# EAGLE design WeldingRectifier (EAGLE 7.4.0)
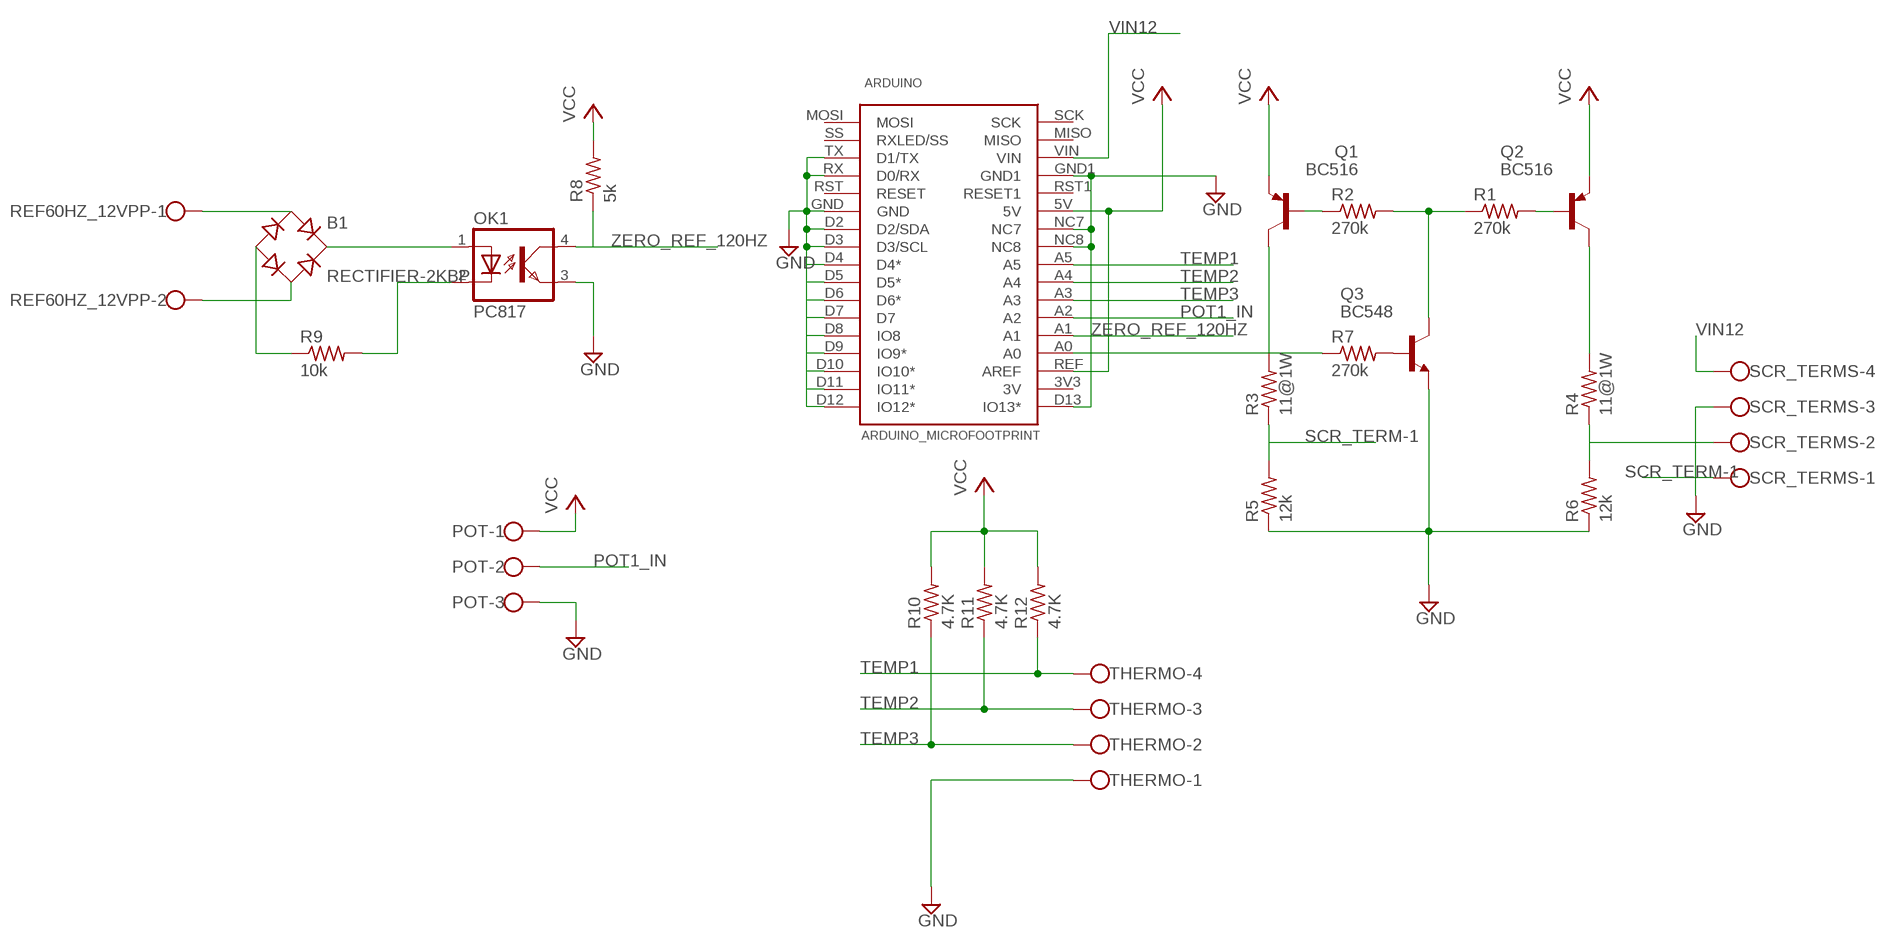
[diagram p0: schematic, sheet 1]

## Parts
ARDUINO  ARDUINO_MICROFOOTPRINT  [ARDUINO-MICRO]
B1  RECTIFIER-2KBP  [2KBP]
OK1  PC817  [DIL04]
POT  W237-103  [W237-103]
Q1  BC516  [TO92-EBC]
Q2  BC516  [TO92-EBC]
Q3  BC548  [TO92-EBC]
R1  270k  R-US_0204/7  [0204/7]
R2  270k  R-US_0204/7  [0204/7]
R3  11@1W  R-US_0204/7  [0204/7]
R4  11@1W  R-US_0204/7  [0204/7]
R5  12k  R-US_0204/7  [0204/7]
R6  12k  R-US_0204/7  [0204/7]
R7  270k  R-US_0204/7  [0204/7]
R8  5k  R-US_0204/7  [0204/7]
R9  10k  R-US_0204/7  [0204/7]
R10  4.7K  R-US_0204/7  [0204/7]
R11  4.7K  R-US_0204/7  [0204/7]
R12  4.7K  R-US_0204/7  [0204/7]
REF60HZ_12VPP  W237-102  [W237-102]
SCR_TERMS  W237-4  [W237-4]
THERMO  W237-4  [W237-4]

## Nets
GND: ARDUINO.D2(D2/SDA) ARDUINO.D3(D3/SCL) ARDUINO.D4(D4*) ARDUINO.D5(D5*) ARDUINO.D6(D6*) ARDUINO.D7 ARDUINO.D8(IO8) ARDUINO.D9(IO9*) ARDUINO.D10(IO10*) ARDUINO.D11(IO11*) ARDUINO.D12(IO12*) ARDUINO.D13(IO13*) ARDUINO.GND ARDUINO.GND1 ARDUINO.NC7 ARDUINO.NC8 ARDUINO.RX(D0/RX) ARDUINO.TX(D1/TX) OK1.3(EMIT) POT.3 Q3.E R5.1 R6.1 SCR_TERMS.3 THERMO.1
N$1: Q1.C R3.2
N$2: Q3.B R7.2
N$3: B1.- R9.1
N$4: R4.1 R6.2 SCR_TERMS.2
N$5: Q2.C R4.2
N$6: Q3.C R1.1 R2.2
N$7: Q1.B R2.1
N$8: Q2.B R1.2
N$9: B1.AC1 REF60HZ_12VPP.1
N$10: B1.AC2 REF60HZ_12VPP.2
N$11: B1.+ OK1.1(A)
N$12: OK1.2(C) R9.2
POT1_IN: ARDUINO.A2 POT.2
SCR_CTRL: ARDUINO.A0 R7.1
SCR_TERM-1: R3.1 R5.2 SCR_TERMS.1
TEMP1: ARDUINO.A5 R12.1 THERMO.4
TEMP2: ARDUINO.A4 R11.1 THERMO.3
TEMP3: ARDUINO.A3 R10.1 THERMO.2
VCC: ARDUINO.5V ARDUINO.REF(AREF) POT.1 Q1.E Q2.E R8.2 R10.2 R11.2 R12.2
VIN12: ARDUINO.VIN SCR_TERMS.4
ZERO_REF_120HZ: ARDUINO.A1 OK1.4(COL) R8.1
Unconnected: ARDUINO.3V3(3V) ARDUINO.MISO ARDUINO.MOSI ARDUINO.RST1(RESET1) ARDUINO.RST(RESET) ARDUINO.SCK ARDUINO.SS(RXLED/SS)

## Library data of the parts
ARDUINO = arduino_micro:ARDUINO_MICRO
B1 = rectifier:RECTIFIER-: Rectifier
OK1 = optocoupler:PC817: SHARP OPTO COUPLER; MPN: PC817X4J000F; OC_FARNELL: 9707727; OC_NEWARK: 97K7059
POT = con-wago-500:W237-103: WAGO SCREW CLAMP; MPN: 237-103; OC_FARNELL: unknown; OC_NEWARK: 18M7116
Q1 Q2 = transistor-pnp:BC516*: PNP Transistror
Q3 = transistor-npn:BC548*: NPN Transistor
R1-R12 = resistor:R-US_: RESISTOR, American symbol
REF60HZ_12VPP = con-wago-500:W237-102: WAGO SCREW CLAMP; MPN: 237-102; OC_FARNELL: unknown; OC_NEWARK: 70K9898
SCR_TERMS THERMO = con-wago-500:W237-4: WAGO SCREW CLAMP; OC_FARNELL: unknown; OC_NEWARK: unknown

## Board
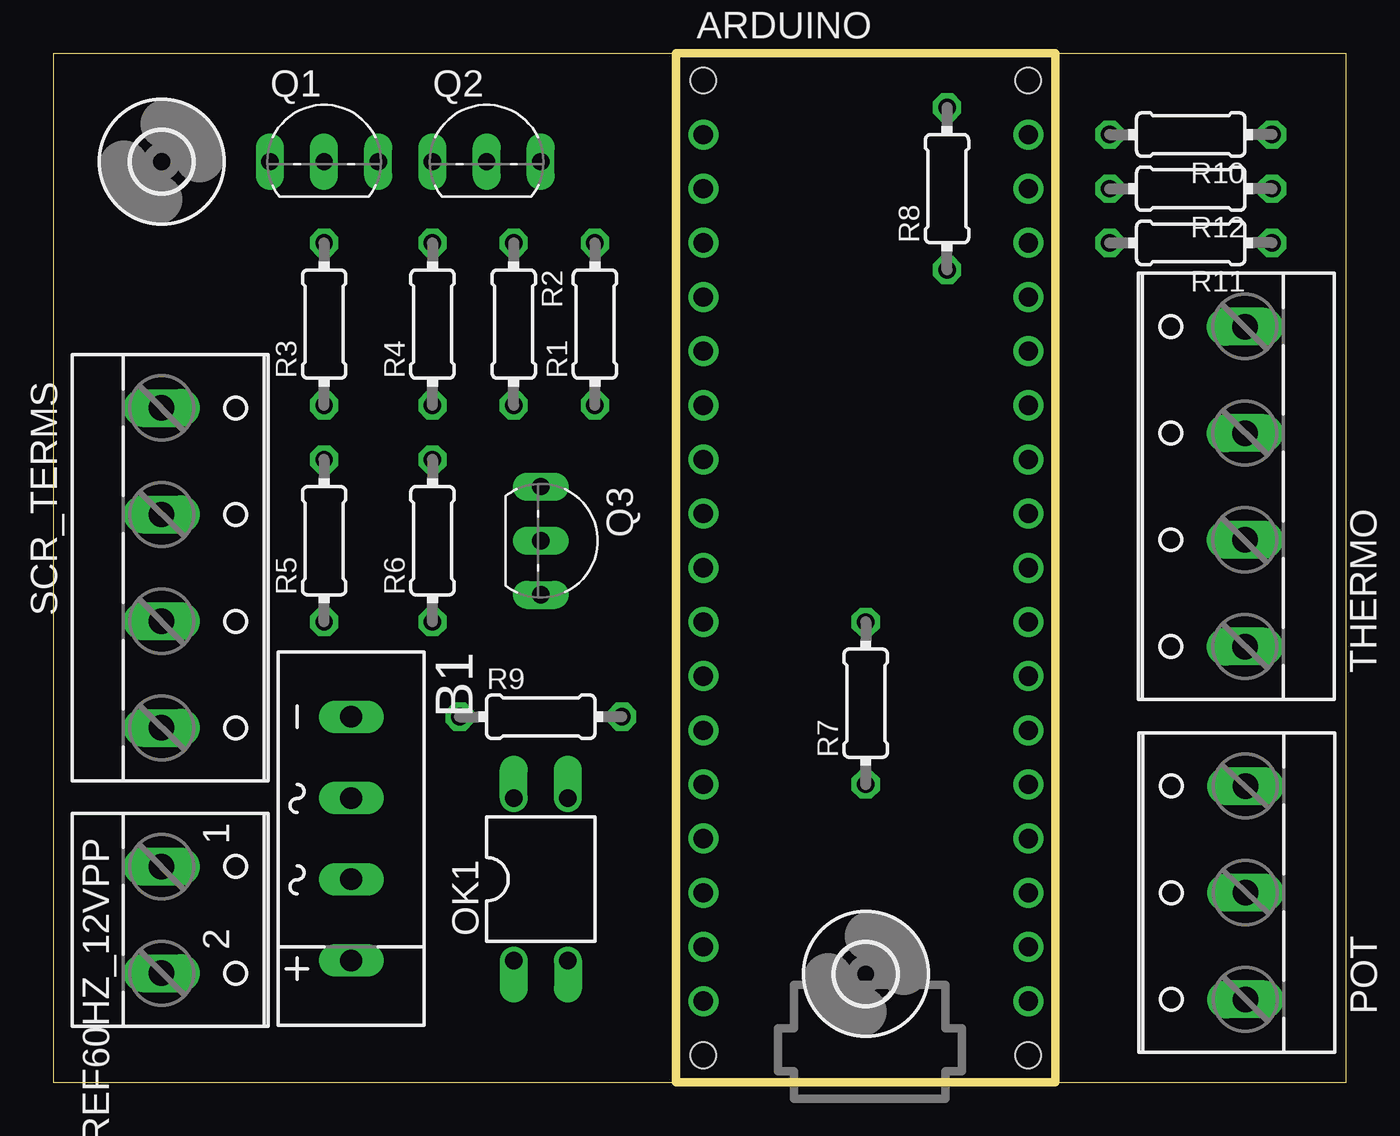
[diagram p1: board, top side]
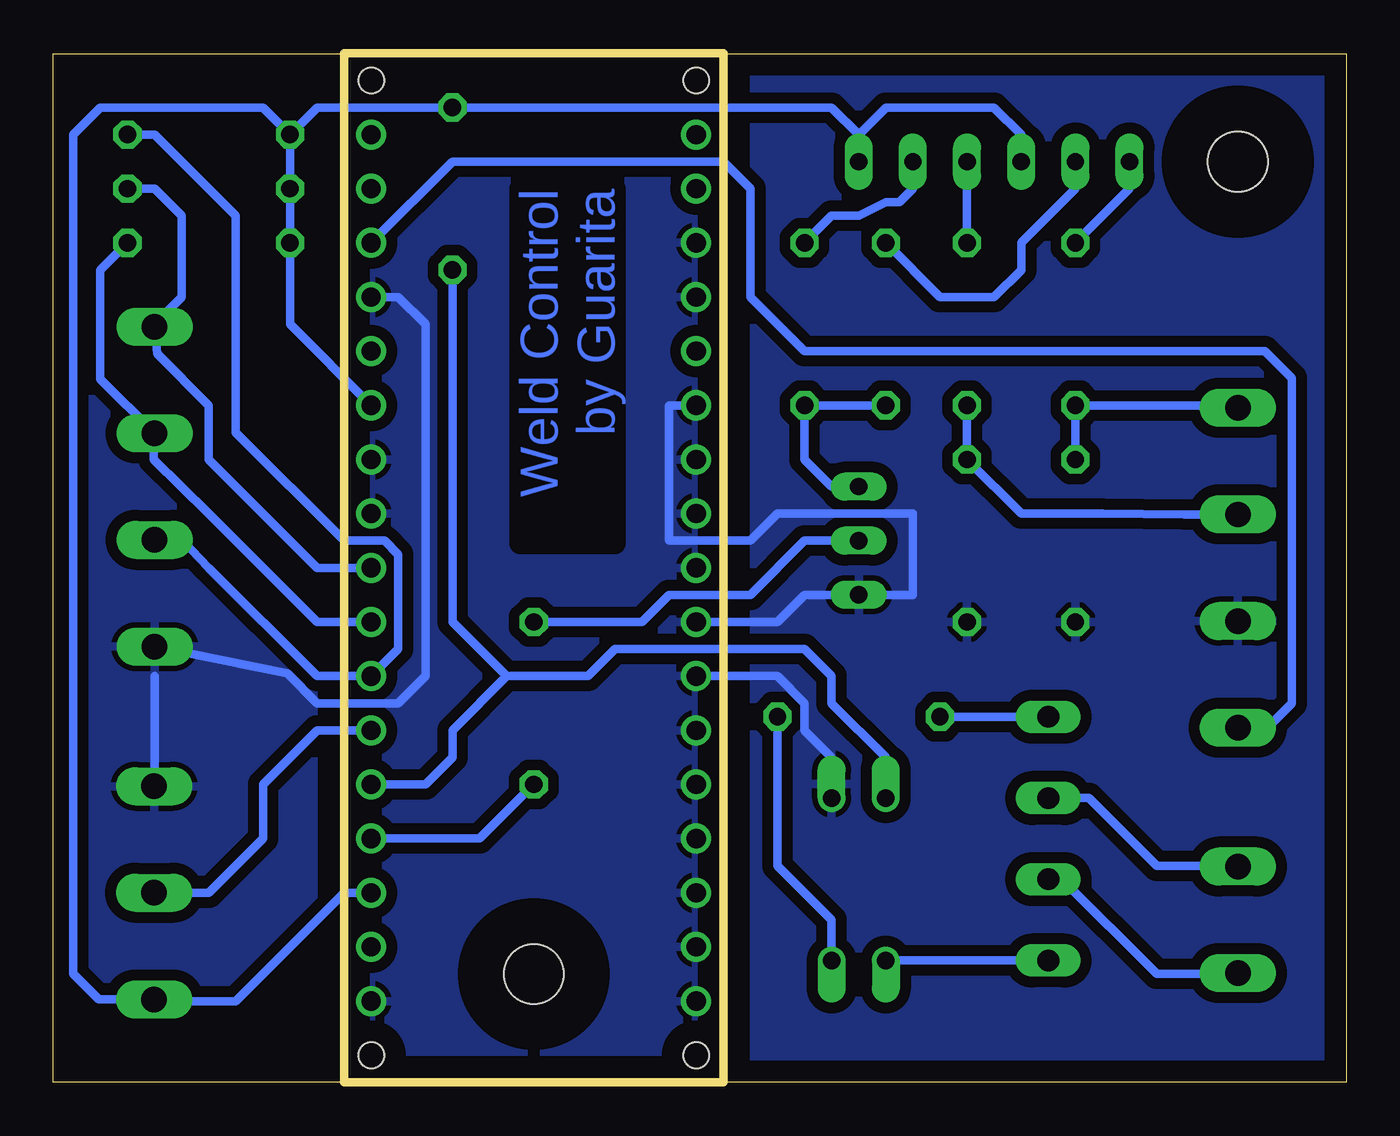
[diagram p2: board, bottom side, seen from below]

Size 60.63 x 48.26 mm. Coordinates in mm from the lower left corner, seen from the top.
Outline: 0,0 60.63,0 60.63,48.25 0,48.25 0,0
Copper layers (1*16): Top 0.035mm / dielectric 1.5mm / Bottom 0.035mm
Design rules "default *": minimum track width 10mil, minimum drill 24mil, track to track 20mil, track to pad 20mil, pad to pad 8mil, via to via 8mil, smd to smd 8mil, copper to edge 40mil, drill to drill 8mil, minimum pad ring 10mil, minimum via ring 8mil, stop-mask expansion 4mil, vias tented up to drill 0mil, thermal gap 10mil

### Footprints (pad centres in the part's own frame; a part is rotated, then mirrored left to right if it is on the bottom)
ARDUINO-MICRO = drill 0.9: 3V3 16.51,3.81; 5V 16.51,29.21; A0 16.51,8.89; A1 16.51,11.43; A2 16.51,13.97; A3 16.51,16.51; A4 16.51,19.05; A5 16.51,21.59; D2 1.27,26.67; D3 1.27,24.13; D4 1.27,21.59; D5 1.27,19.05; D6 1.27,16.51; D7 1.27,13.97; D8 1.27,11.43; D9 1.27,8.89; D10 1.27,6.35; D11 1.27,3.81; D12 1.27,1.27; D13 16.51,1.27; GND 1.27,29.21; GND1 16.51,34.29; MISO 16.51,39.37; MOSI 1.27,41.91; NC7 16.51,26.67; NC8 16.51,24.13; REF 16.51,6.35; RST 1.27,31.75; RST1 16.51,31.75; RX 1.27,34.29; SCK 16.51,41.91; SS 1.27,39.37; TX 1.27,36.83; VIN 16.51,36.83 | hole 1.2: 1.27,-1.27; 16.51,-1.27; 1.27,44.45; 16.51,44.45
2KBP = drill 1.016 long: + 5.715,0; - -5.715,0; AC1 -1.905,0; AC2 1.905,0
DIL04 = drill 0.813 offset: 1 -1.27,-3.81; 2 1.27,-3.81; 3 1.27,3.81; 4 -1.27,3.81
W237-103 = drill 1.194 long: 1 -5,-1.29; 2 0,-1.29; 3 5,-1.29
TO92-EBC = drill 0.813 long: B 0,-1.27; C -2.54,-1.27; E 2.54,-1.27
0204/7 = drill 0.813 octagon: 1 -3.81,0; 2 3.81,0
W237-102 = drill 1.194 long: 1 -2.5,-1.27; 2 2.5,-1.27
W237-4 = drill 1.194 long: 1 -7.5,-1.27; 2 -2.5,-1.27; 3 2.5,-1.27; 4 7.5,-1.27
2,8 = hole 2.8: 0,0

### Placement (x,y rotation side)
ARDUINO  29.21,2.54 0 top
B1  13.97,11.43 270 top
OK1  22.86,9.53 0 top
POT  54.61,8.89 90 top
Q1  12.7,44.45 0 top
Q2  20.32,44.45 0 top
Q3  24.13,25.4 270 top
R1  25.4,35.56 90 top
R2  21.59,35.56 270 top
R3  12.7,35.56 90 top
R4  17.78,35.56 90 top
R5  12.7,25.4 90 top
R6  17.78,25.4 90 top
R7  38.1,17.78 90 top
R8  41.91,41.91 90 top
R9  22.86,17.14 0 top
R10  53.34,44.45 180 top
R11  53.34,39.37 180 top
R12  53.34,41.91 180 top
REF60HZ_12VPP  6.35,7.62 270 top
SCR_TERMS  6.35,24.13 270 top
THERMO  54.61,27.94 90 top
U$1  [2,8]  5.08,43.18 0 top
U$3  [2,8]  38.1,5.08 0 top

### Tracks (layer width: path | path; a pad name or v marks a point on that pad's centre or on a via)
GND
  Bottom 0.406: POT.3 55.9,13.95 55.88,13.97 55.88,19.05 | THERMO.1 49.65,19.17 48.26,17.78 44.45,17.78 43.18,19.05 43.18,35.56 44.45,36.83 ARDUINO.GND1 | ARDUINO.GND 31.75,31.75 31.75,25.4 27.94,25.4 26.67,26.67 20.32,26.67 20.32,22.86 Q3.E 25.4,22.86 26.67,21.59 ARDUINO.D5 | ARDUINO.D6 26.67,19.05 25.4,17.78 25.4,16.51 24.13,15.24 OK1.3
  pour Bottom: -3.81,60.96 96.52,60.96 96.52,-5.08 88.9,-5.08 1.27,-6.35 -3.81,-6.35
N$1
  Bottom 0.406: Q1.C 10.16,41.91 R3.2
N$2
  Bottom 0.406: R7.2 33.02,21.59 31.75,22.86 27.94,22.86 25.4,25.4 Q3.B
N$3
  Bottom 0.406: B1.- R9.1
N$4
  Bottom 0.406: SCR_TERMS.2 7.58,26.63 11.43,26.67 15.24,26.67 R6.2 R4.1
N$5
  Bottom 0.406: Q2.C R4.2
N$6
  Bottom 0.406: R2.2 R1.1 25.4,29.21 24.13,27.94 Q3.C
N$7
  Bottom 0.406: Q1.B 12.7,41.91 15.24,39.37 15.24,38.1 16.51,36.83 19.05,36.83 R2.1
N$8
  Bottom 0.406: Q2.B 20.32,41.91 20.95,41.27 21.59,41.27 22.86,40.64 24.13,40.64 R1.2
N$9
  Bottom 0.406: B1.AC1 12.06,13.34 8.89,10.16 5.12,10.16 REF60HZ_12VPP.1
N$10
  Bottom 0.406: B1.AC2 13.33,9.53 8.89,5.08 5.12,5.08 REF60HZ_12VPP.2
N$11
  Bottom 0.406: B1.+ OK1.1
N$12
  Bottom 0.406: R9.2 26.67,10.16 24.13,7.62 OK1.2
POT1_IN
  Bottom 0.406: ARDUINO.A2 48.26,16.51 50.8,13.97 50.8,11.43 53.34,8.89 POT.2
SCR_CTRL
  Bottom 0.406: R7.1 40.64,11.43 ARDUINO.A0
SCR_TERM-1
  Bottom 0.406: SCR_TERMS.1 5.2,31.75 R3.1 R5.2
TEMP1
  Bottom 0.406: R12.1 55.88,41.91 54.61,40.64 54.61,36.83 55.88,35.56 THERMO.4 55.76,34.17 53.34,31.75 53.34,29.21 48.26,24.13 ARDUINO.A5
TEMP2
  Bottom 0.406: ARDUINO.A4 48.26,21.59 53.34,26.67 55.92,29.21 THERMO.3 58.42,32.98 58.42,38.1 R11.1
TEMP3
  Bottom 0.406: THERMO.2 54.57,25.4 53.34,24.13 48.26,19.05 ARDUINO.A3 44.45,20.32 44.45,24.77 45.09,25.4 46.99,25.4 52.07,30.48 52.07,40.64 55.88,44.45 R10.1
VCC
  Bottom 0.406: R10.2 R12.2 R11.2 49.53,35.56 ARDUINO.5V | R10.2 48.26,45.72 R8.2 24.13,45.72 22.86,44.45 | R10.2 50.8,45.72 58.42,45.72 59.69,44.45 59.69,5.08 58.5,3.89 POT.1 55.82,3.81 52.07,3.81 46.99,8.89 ARDUINO.REF | 22.86,44.45 21.59,45.72 16.51,45.72 15.24,44.45 Q1.E | Q2.E 22.86,44.45
VIN12
  Bottom 0.406: SCR_TERMS.4 3.69,16.63 2.54,17.78 2.54,33.02 3.81,34.29 25.4,34.29 27.94,36.83 27.94,41.91 29.21,43.18 41.91,43.18 ARDUINO.VIN
ZERO_REF_120HZ
  Bottom 0.406: OK1.4 21.59,15.24 24.13,17.78 24.13,19.05 25.4,20.32 34.29,20.32 35.56,19.05 39.37,19.05 | 39.37,19.05 41.91,16.51 41.91,15.24 43.18,13.97 ARDUINO.A1 | R8.1 41.91,21.59 39.37,19.05

### Text on the board
Bottom: Weld Control / by Guarita